# Altium schematic sheet 02-USER_IO_STATUS.SchDoc: Time Card
size A3; SheetNumber: 2; SheetTotal: 8; ENG_APP_DATE: --/--/--; DSN_APP_DATE: --/--/--; CHK_APP_DATE: --/--/--
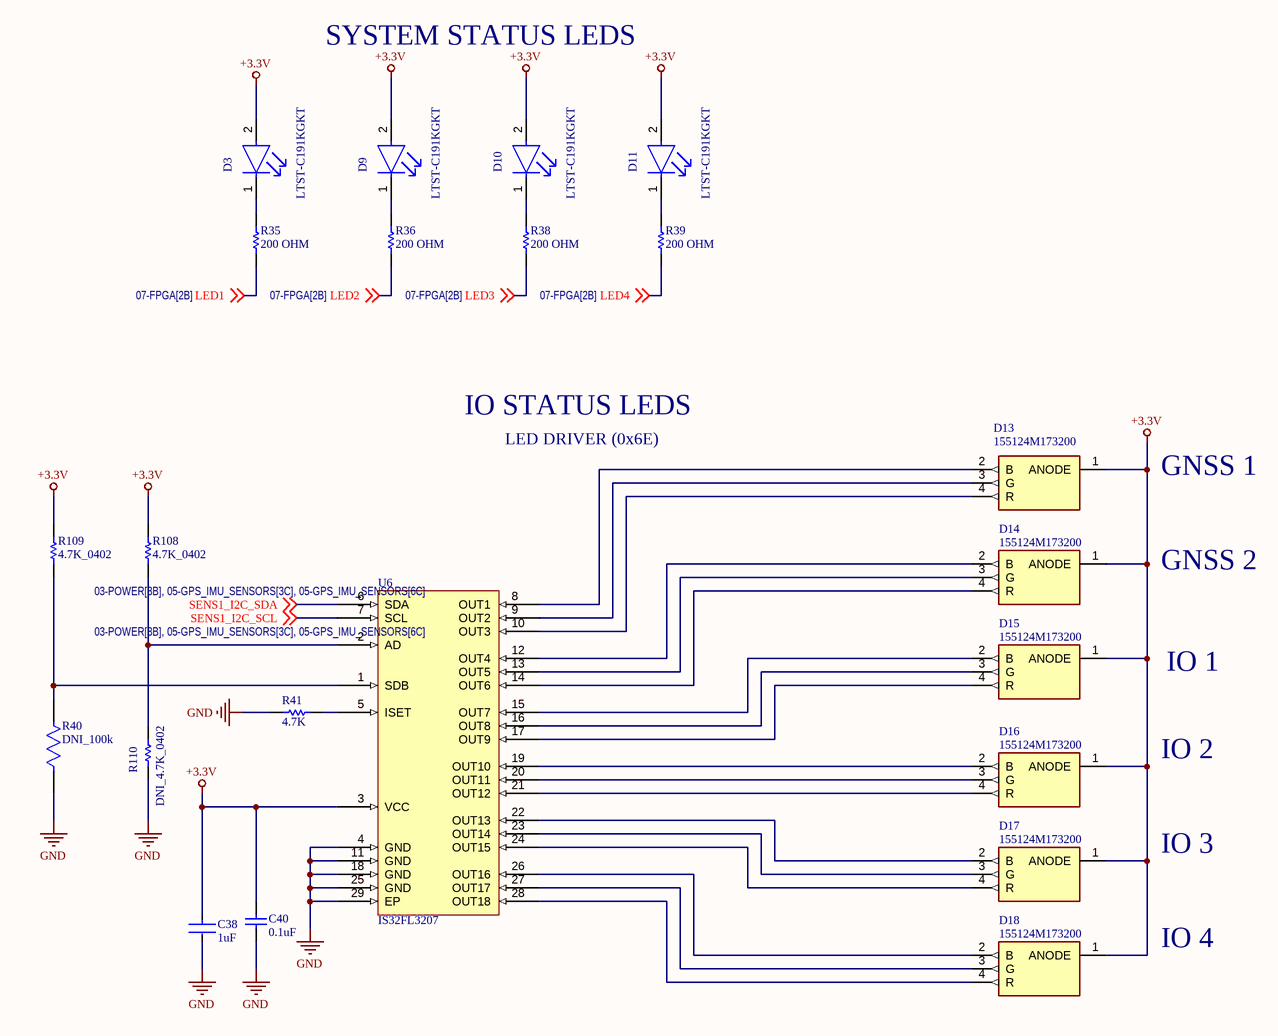
[diagram p0: 02-USER_IO_STATUS.SchDoc]

## Parts
C38  1uF  [FP-C0603C105K3PACTU-MFG]
C40  0.1uF  [CAPC1608X87X45ML20T05]
D3  LTST-C191KGKT  [FP-LTST-C191KGKT-MFG]
D9  LTST-C191KGKT  [FP-LTST-C191KGKT-MFG]
D10  LTST-C191KGKT  [FP-LTST-C191KGKT-MFG]
D11  LTST-C191KGKT  [FP-LTST-C191KGKT-MFG]
D13  155124M173200  [155124M173200]
D14  155124M173200  [155124M173200]
D15  155124M173200  [155124M173200]
D16  155124M173200  [155124M173200]
D17  155124M173200  [155124M173200]
D18  155124M173200  [155124M173200]
R35  200 OHM  [RESC1608X55X30NL15T15]
R36  200 OHM  [RESC1608X55X30NL15T15]
R38  200 OHM  [RESC1608X55X30NL15T15]
R39  200 OHM  [RESC1608X55X30NL15T15]
R40  DNI_100k  [FP-RC0603-0_55-MFG]  (no BOM)
R41  4.7K  [RESC1608X55X30NL15T15]
R108  4.7K_0402  [RESC1005X40X25LL05T05]
R109  4.7K_0402  [RESC1005X40X25LL05T05]
R110  DNI_4.7K_0402  [RESC1005X40X25LL05T05]  (no BOM)
U6  IS32FL3207  [IS32FL3207]

## Nets
+3.3V: C38.1 C40.2 D3.2(A) D9.2(A) D10.2(A) D11.2(A) D13.1(ANODE) D14.1(ANODE) D15.1(ANODE) D16.1(ANODE) D17.1(ANODE) D18.1(ANODE) R108.1 R109.1 U6.3(VCC)
GND: C38.2 C40.1 R40.1 R41.1 R110.2 U6.4(GND) U6.11(GND) U6.18(GND) U6.25(GND) U6.29(EP)
LED1: R35.1 ; off-sheet LED1
LED2: R36.1 ; off-sheet LED2
LED3: R38.1 ; off-sheet LED3
LED4: R39.1 ; off-sheet LED4
SENS1_I2C_SCL: U6.7(SCL) ; off-sheet SENS1_I2C_SCL
SENS1_I2C_SDA: U6.6(SDA) ; off-sheet SENS1_I2C_SDA
NetD3_1: D3.1(C) R35.2
NetD9_1: D9.1(C) R36.2
NetD10_1: D10.1(C) R38.2
NetD11_1: D11.1(C) R39.2
NetD13_2: D13.2(B) U6.8(OUT1)
NetD13_3: D13.3(G) U6.9(OUT2)
NetD13_4: D13.4(R) U6.10(OUT3)
NetD14_2: D14.2(B) U6.12(OUT4)
NetD14_3: D14.3(G) U6.13(OUT5)
NetD14_4: D14.4(R) U6.14(OUT6)
NetD15_2: D15.2(B) U6.15(OUT7)
NetD15_3: D15.3(G) U6.16(OUT8)
NetD15_4: D15.4(R) U6.17(OUT9)
NetD16_2: D16.2(B) U6.19(OUT10)
NetD16_3: D16.3(G) U6.20(OUT11)
NetD16_4: D16.4(R) U6.21(OUT12)
NetD17_2: D17.2(B) U6.22(OUT13)
NetD17_3: D17.3(G) U6.23(OUT14)
NetD17_4: D17.4(R) U6.24(OUT15)
NetD18_2: D18.2(B) U6.26(OUT16)
NetD18_3: D18.3(G) U6.27(OUT17)
NetD18_4: D18.4(R) U6.28(OUT18)
NetR40_2: R40.2 R109.2 U6.1(SDB)
NetR41_2: R41.2 U6.5(ISET)
NetR108_2: R108.2 R110.1 U6.2(AD)

## Notes on the sheet
- SYSTEM STATUS LEDS
- IO STATUS LEDS
- LED DRIVER (0x6E)
- GNSS 1
- GNSS 2
- IO 1
- IO 2
- IO 3
- IO 4
- DWG. NO.
- REV.
- SHT.
- THIS DOCUMENT AND THE DATA DISCLOSED HEREIN OR HEREWITH IS THE PROPERTY OF ALTIUM LIMITED AND MAY BE FREELY DISTRIBUTED IN WHOLE. NO RIGHTS ARE RESERVED OR EXPRESS OR IMPLIED WARANTEE GIVEN.
- REVISION
- DESCRIPTION
- DATE
- APPROVED
- ENG:
- APPROVALS
- PROJECT
- DSN:
- CHK:
- REFERENCE DOCUMENTS
- PROJECT REVISION:
- TITLE
- DOCUMENT REVISION:
- DESIGN ITEM:
- BOM:
- FAB DWG:
- PCB DWG:
- ASSY DWG:
- SCALE:
- SIZE
- B
- CAGE CODE
- FILE NAME
- DWG NO.
- SHEET
- OF
- REV

## Library data of the parts
C38 = CMP-2006-02216-3: CAP CER 1UF 25V X5R 0603; Dielectric Material: Ceramic; Tolerance: 10%; Contact Plating: Tin; Number of Pins: 2; Lead Free: Lead Free; Depth: 0.8mm; Length: 1.6mm; Mount: Surface Mount; Case Code (Metric): 1608; Max Operating Temperature: 85°C; Voltage: 25V; Voltage Rating (DC): 25V; REACH SVHC: No SVHC; Height: 0.8mm; Series: C0603C; Case/Package: 0603; Case Code (Imperial): 0603; Capacitance: 1uF; RoHS Compliant: Yes; Dielectric: X5R; Packaging: Tape and Reel; Construction: Flat; Thickness: 0.034inch; Voltage Rating: 25V; Radiation Hardening: No; Width: 0.031inch; Min Operating Temperature: -55°C; Termination: SMD/SMT; Package Quantity: 4000
C40 = CMP-2006-00003-1: C0603X104K5RACAUTO; Manufacturer: Kemet; Part Number: C0603X104K5RACAUTO
D3 D9-D11 = CMP-2000-05198-2: LED GREEN CLEAR SMD; Max Power Dissipation: 75mW; Forward Current: 30mA; Reverse Voltage: 5V; Lens Color: Colorless; Forward Voltage: 2V; Dominant Wavelength: 571nm; Number of LEDs: 1; Viewing Angle: 130°; Lens Style: Rectangular; Test Current: 20mA; Luminous Intensity: 35mcd; Wavelength: 574nm; Width: 0.8mm; Case Code (Imperial): 0603; Number of Pins: 2; Lead Free: Lead Free; Packaging: Tape and Reel; Package Quantity: 1; Min Operating Temperature: -55°C; Case/Package: 0603; Length: 1.6mm; Power Dissipation: 75mW; Depth: 0.8mm; Radiation Hardening: No; Mount: Surface Mount; Max Operating Temperature: 85°C; Color: Green; Power Rating: 75mW; Height: 0.55mm; Illumination Color: Green; Case Code (Metric): 1608; Lens Transparency: Clear; Number of Elements: 1
D13-D18 = 155124M173200: LED (Multiple); Manufacturer_Name: Wurth Elektronik; Datasheet Link: https://www.mouser.com/ds/2/445/155124M173200-1113601.pdf; Manufacturer_Part_Number: 155124M173200; Mouser Part Number: 710-155124M173200; Mouser Price/Stock: https://www.mouser.co.uk/ProductDetail/Wurth-Elektronik/155124M173200?qs=5aG0NVq1C4xPhoUU07x4gQ%3D%3D
R35 R36 R38 R39 = CMP-2000-00316-1: ERJ-3EKF2000V; Manufacturer: Panasonic; Part Number: ERJ-3EKF2000V
R40 = CMP-2100-03662-2: RES SMD 100K OHM 1% 1/10W 0603; Voltage Rating (DC): 50V; Resistance: 100kR; Max Power Dissipation: 100mW; Temperature Coefficient: 100ppm/°C; Working Voltage: 75V; Length: 1.6mm; Lead Free: Lead Free; Number of Terminations: 2; Packaging: Tape and Reel; Voltage Rating: 50V; Termination: SMD/SMT; Width: 0.8mm; Resistor Type: Thick Film; Resistance Tolerance: 1%; Features: Moisture Resistant; Height: 0.45mm; Construction: Rectangular; Case/Package: 0603; Military Standard: Not; Case Code (Imperial): 0603; Series: RC; Technology: THICK FILM; Depth: 0.8mm; RoHS Compliant: Yes; REACH SVHC: No SVHC; Min Operating Temperature: -55°C; Case Code (Metric): 1608; Max Operating Temperature: 155°C; Power Rating: 100mW; Number of Pins: 2; Tolerance: 1%
R41 = CMP-1012-00586-3: Precision Thick Film Chip Resistor, 4.7 KOhm, +/- 1%, -55 to 155 degC, 0603 (1608 Metric), RoHS, Tape and Reel ERJ-3EKF4701V; Resistance: 220 Ohm; Voltage Rating: 50 V; Elements: 4; Case\Package: 1205; Tolerance: 5%; Power Rating: 250 mW; PackageReference: 0603; Max Operating Temperature: 125 degC; REACH SVHC: No SVHC; Width: 0.063 inch; Length: 0.126 inch; Height: 0.024 inch; Mount: Surface Mount; Package Quantity: 1; DatasheetVersion: Apr-15; ComponentLink1Description: Manufacturer URL; Min Operating Temperature: -55 degC; Packaging: Tape and Reel; Radiation Hardening: No; ComponentLink2URL: http://industrial.panasonic.com/cdbs/www-data/pdf/RDA0000/AOA0000C86.pdf; Case Code (Metric): 3216; Pins: 8; Case Code (Imperial): 1206; Type (Resistor): Thick Film; RoHSCompliant: true; ComponentLink2Description: Datasheet; PackageDescription: 2-Pin Surface Mount Device, Body 1.6 x 0.85 mm; ComponentLink1URL: http://www.panasonic.com/
R108-R110 = CMP-2002-01154-4: Chip Resistor, 4.7 KOhm, +/- 1%, 0.1 W, -55 to 155 degC, 0402 (1005 Metric), RoHS, Tape and Reel; PartNumber: ERJ-2RKF4701X; Voltage Rating: 50 V; Case\/Package: 0402; Power Rating: 100 mW; Height: 0.35 mm; Mounting Technology: Surface Mount; REACH SVHC: Yes; Resistance: 4.7 KOhm; Max Operating Temperature: 155 degC; ComponentLink1Description: Manufacturer URL; ComponentLink2Description: Datasheet; Pins: 2; PackageReference: 0402; Tolerance: 1%; Case Code (Imperial): 0402; Length: 1 mm; PackageDescription: 2-Pin Surface Mount Device, Body 1 x 0.5 mm; RoHSCompliant: true; Package Quantity: 1; Radiation Hardening: No; DatasheetVersion: 04/2015; Width: 0.5 mm; Case Code (Metric): 1005; Mount: Surface Mount; ComponentLink1URL: http://www.panasonic.com/; Min Operating Temperature: -55 degC; Packaging: Cut Tape; ComponentLink2URL: http://industrial.panasonic.com/cdbs/www-data/pdf/RDA0000/AOA0000C86.pdf